# EAGLE design D14_1_0 (EAGLE 8.3.2)
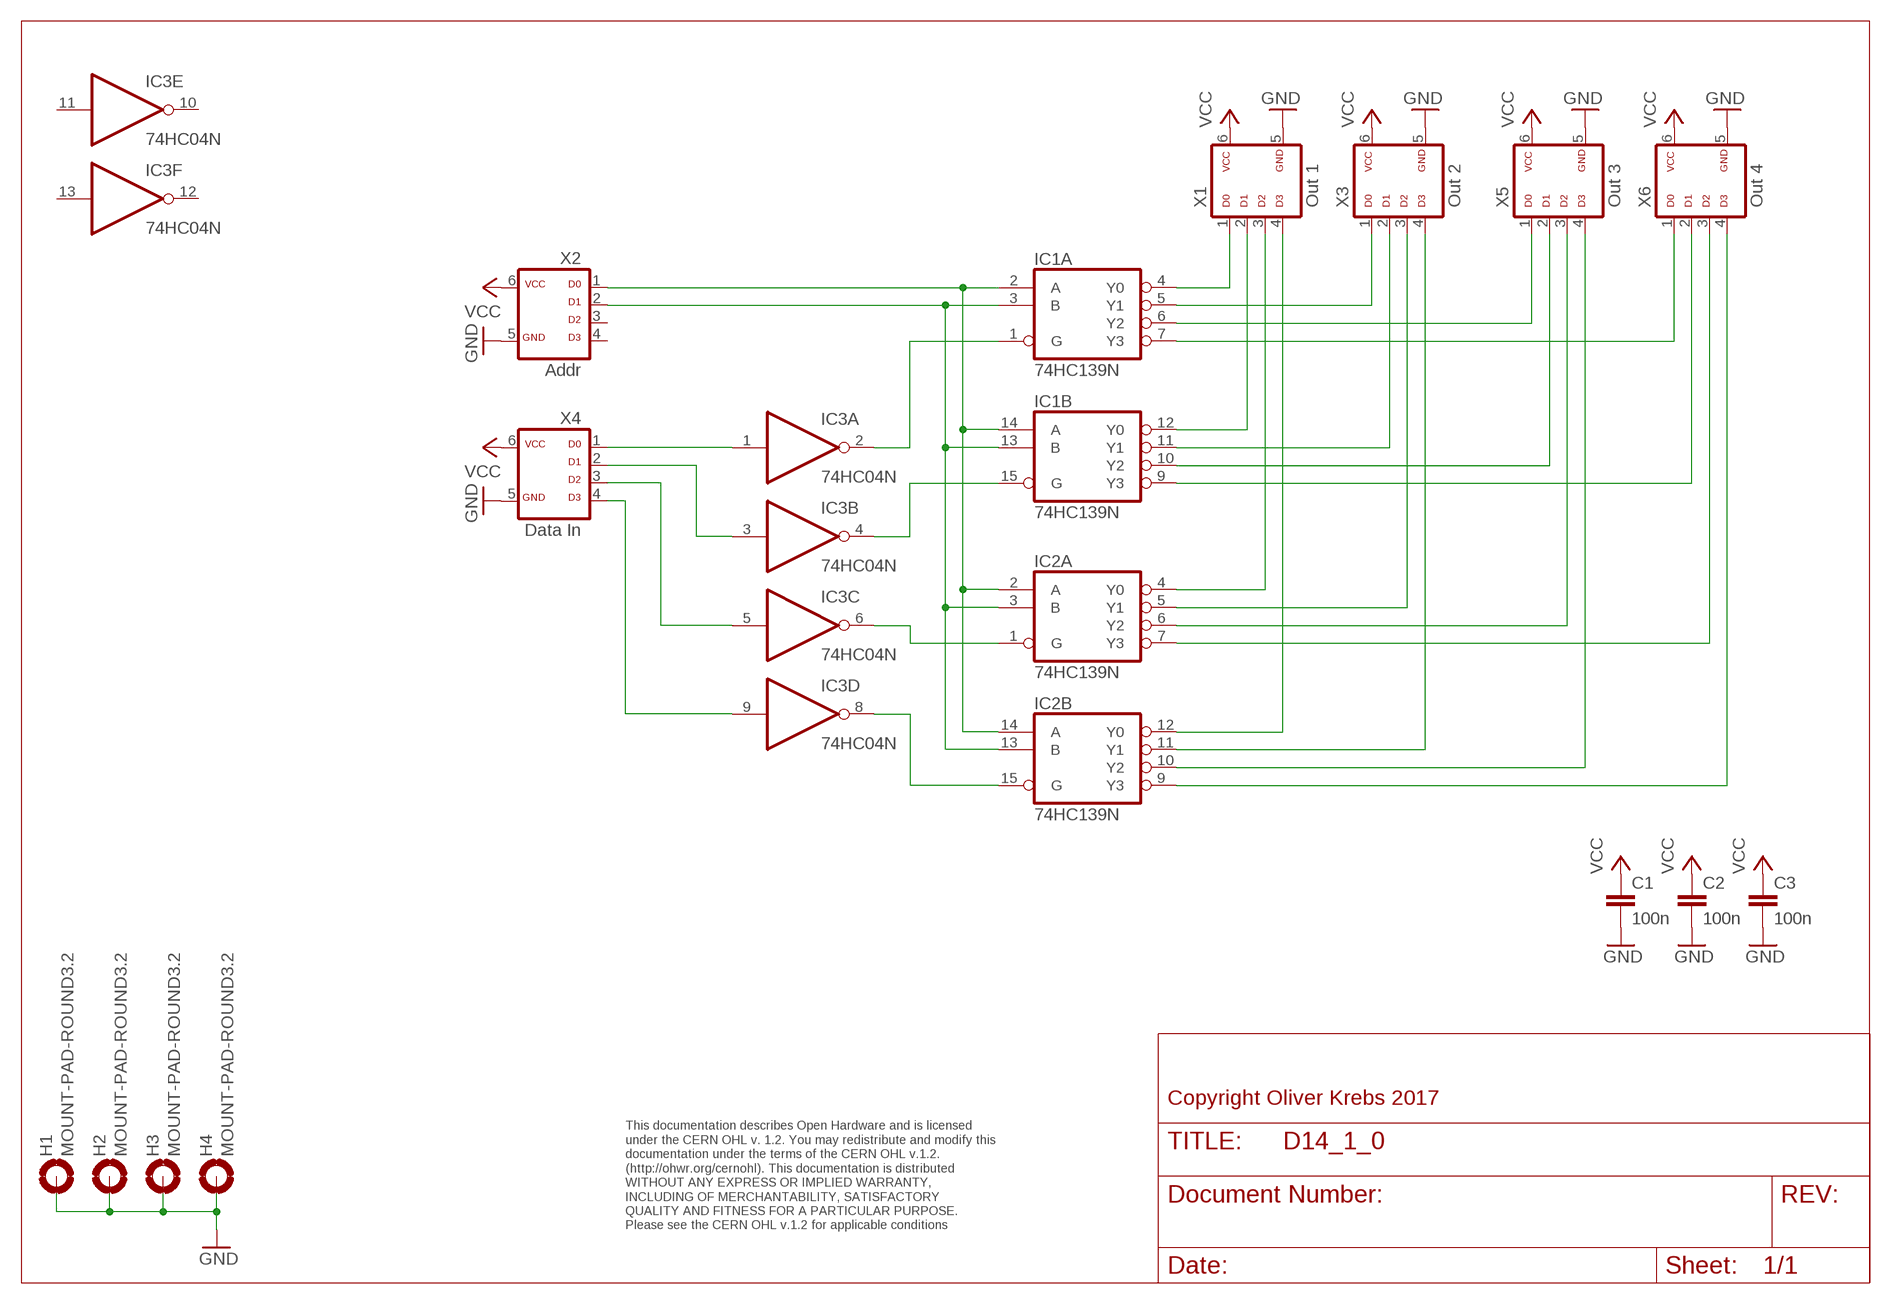
[diagram p0: schematic, sheet 1]

## Parts
C1  100n  C-EU050-025X075  [C050-025X075]
C2  100n  C-EU050-025X075  [C050-025X075]
C3  100n  C-EU050-025X075  [C050-025X075]
H1  MOUNT-PAD-ROUND3.2  [3,2-PAD]
H2  MOUNT-PAD-ROUND3.2  [3,2-PAD]
H3  MOUNT-PAD-ROUND3.2  [3,2-PAD]
H4  MOUNT-PAD-ROUND3.2  [3,2-PAD]
IC1  74HC139N  [DIL16]
IC2  74HC139N  [DIL16]
IC3  74HC04N  [DIL14]
X1  Out 1  ML6D  [ML-6]
X2  Addr  ML6D  [ML-6]
X3  Out 2  ML6D  [ML-6]
X4  Data In  ML6D  [ML-6]
X5  Out 3  ML6D  [ML-6]
X6  Out 4  ML6D  [ML-6]

## Nets
GND: C1.2 C2.2 C3.2 H1.B3,2(MOUNT) H2.B3,2(MOUNT) H3.B3,2(MOUNT) H4.B3,2(MOUNT) X1.5 X2.5 X3.5 X4.5 X5.5 X6.5
N$1: IC1.2(A:A) IC1.14(B:A) IC2.2(A:A) IC2.14(B:A) X2.1
N$2: IC1.3(A:B) IC1.13(B:B) IC2.3(A:B) IC2.13(B:B) X2.2
N$3: IC1.4(A:Y0) X1.1
N$4: IC1.12(B:Y0) X1.2
N$5: IC2.4(A:Y0) X1.3
N$6: IC2.12(B:Y0) X1.4
N$7: IC1.5(A:Y1) X3.1
N$8: IC1.11(B:Y1) X3.2
N$9: IC2.5(A:Y1) X3.3
N$10: IC2.11(B:Y1) X3.4
N$11: IC1.6(A:Y2) X5.1
N$12: IC1.10(B:Y2) X5.2
N$13: IC2.6(A:Y2) X5.3
N$14: IC2.10(B:Y2) X5.4
N$15: IC1.7(A:Y3) X6.1
N$16: IC1.9(B:Y3) X6.2
N$17: IC2.7(A:Y3) X6.3
N$18: IC2.9(B:Y3) X6.4
N$19: IC1.1(A:G) IC3.2(A:O)
N$20: IC1.15(B:G) IC3.4(B:O)
N$21: IC2.1(A:G) IC3.6(C:O)
N$22: IC2.15(B:G) IC3.8(D:O)
N$23: IC3.1(A:I) X4.1
N$24: IC3.3(B:I) X4.2
N$25: IC3.5(C:I) X4.3
N$26: IC3.9(D:I) X4.4
VCC: C1.1 C2.1 C3.1 X1.6 X2.6 X3.6 X4.6 X5.6 X6.6
Unconnected: IC3.10(E:O) IC3.11(E:I) IC3.12(F:O) IC3.13(F:I) X2.3 X2.4

## Notes on the sheet
- Copyright Oliver Krebs 2017
- This documentation describes Open Hardware and is licensed 
  under the CERN OHL v. 1.2. You may redistribute and modify this 
  documentation under the terms of the CERN OHL v.1.2. 
  (http://ohwr.org/cernohl). This documentation is distributed
  WITHOUT ANY EXPRESS OR IMPLIED WARRANTY, 
  INCLUDING OF MERCHANTABILITY, SATISFACTORY 
  QUALITY AND FITNESS FOR A PARTICULAR PURPOSE. 
  Please see the CERN OHL v.1.2 for applicable conditions

## Power pins joined to a net without a drawn wire
GND: IC1.8(P:GND) IC2.8(P:GND) IC3.7(P:GND)
VCC: IC1.16(P:VCC) IC2.16(P:VCC) IC3.14(P:VCC)

## Library data of the parts
C1-C3 = 01-my_rcl:C-EU: CAPACITOR, European symbol
H1-H4 = holes:MOUNT-PAD-ROUND: MOUNTING PAD, round
IC1 IC2 = 74xx-eu:74*139: Dual 2-line to 4-line DECODER/DEMULTIPLEXER
IC3 = 74xx-eu:74*04: Hex INVERTER
X1-X6 = 01-my-con:ML6D

## Board
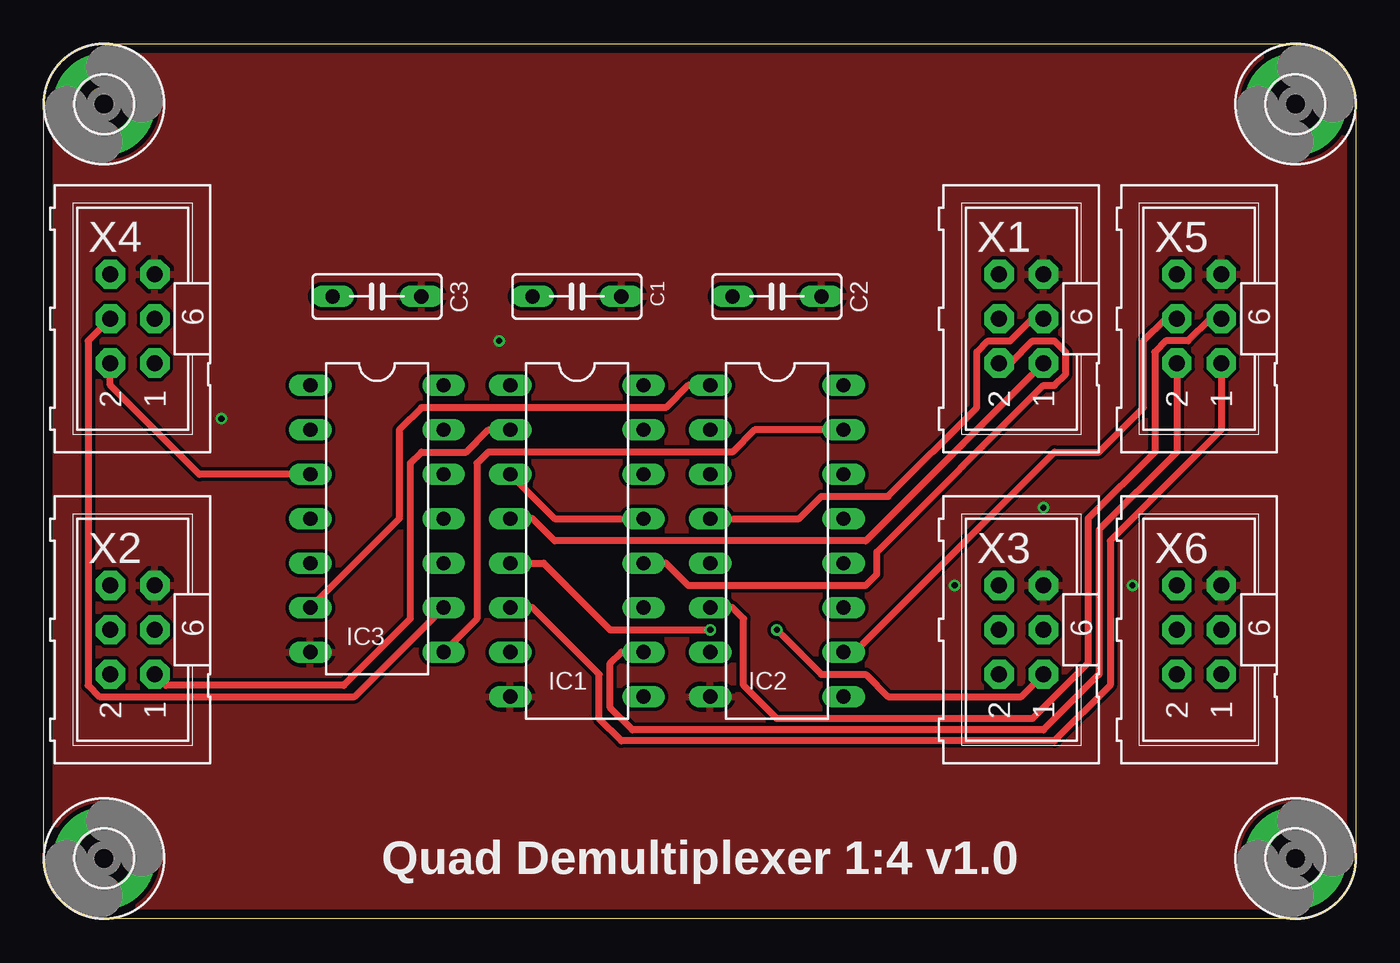
[diagram p1: board, top side]
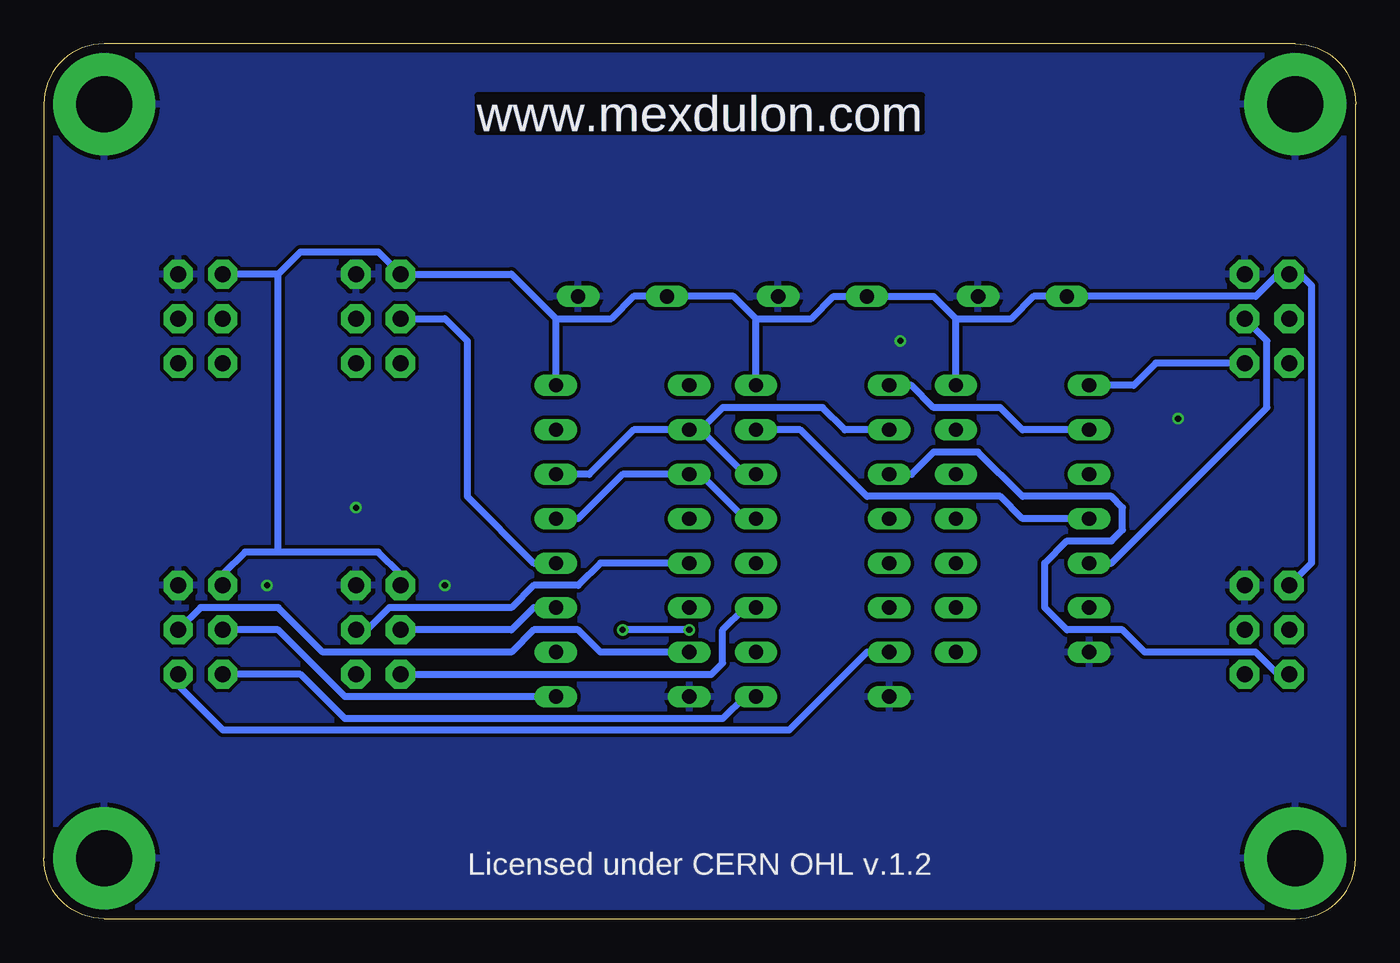
[diagram p2: board, bottom side, seen from below]

Size 75 x 50 mm. Coordinates in mm from the lower left corner, seen from the top.
Outline: 0,3.45 0,46.55 arc-90 3.45,50 71.55,50 arc-90 75,46.55 75,3.45 arc-90 71.55,0 3.45,0 arc-90 0,3.45
Copper layers (1*16): Top 0.035mm / dielectric 1.6mm / Bottom 0.035mm
Design rules "Elecrow_2-layer_PCB_eagle_rule_8mil": minimum track width 8mil, minimum drill 12mil, track to track 8mil, track to pad 8mil, pad to pad 8mil, via to via 8mil, smd to smd 0mil, copper to edge 20mil, drill to drill 10mil, minimum pad ring 6mil, minimum via ring 6mil, stop-mask expansion 0mil, vias tented up to drill 100mil, thermal gap 10mil

### Footprints (pad centres in the part's own frame; a part is rotated, then mirrored left to right if it is on the bottom)
C050-025X075 = drill 0.813 long: 1 -2.54,0; 2 2.54,0
3,2-PAD = drill 3.2 pad 5.842: B3,2 0,0
DIL16 = drill 0.813 long: 1 -8.89,-3.81; 2 -6.35,-3.81; 3 -3.81,-3.81; 4 -1.27,-3.81; 5 1.27,-3.81; 6 3.81,-3.81; 7 6.35,-3.81; 8 8.89,-3.81; 9 8.89,3.81; 10 6.35,3.81; 11 3.81,3.81; 12 1.27,3.81; 13 -1.27,3.81; 14 -3.81,3.81; 15 -6.35,3.81; 16 -8.89,3.81
DIL14 = drill 0.813 long: 1 -7.62,-3.81; 2 -5.08,-3.81; 3 -2.54,-3.81; 4 0,-3.81; 5 2.54,-3.81; 6 5.08,-3.81; 7 7.62,-3.81; 8 7.62,3.81; 9 5.08,3.81; 10 2.54,3.81; 11 0,3.81; 12 -2.54,3.81; 13 -5.08,3.81; 14 -7.62,3.81
ML-6 = drill 0.914 pad 1.676 octagon: 1 -2.54,-1.27; 2 -2.54,1.27; 3 0,-1.27; 4 0,1.27; 5 2.54,-1.27; 6 2.54,1.27

### Placement (x,y rotation side)
C1  30.48,35.56 0 top
C2  41.91,35.56 0 top
C3  19.05,35.56 0 top
H1  3.45,3.45 0 top
H2  3.45,46.55 0 top
H3  71.55,46.55 0 top
H4  71.55,3.45 0 top
IC1  30.48,21.59 270 top
IC2  41.91,21.59 270 top
IC3  19.05,22.86 270 top
X1  55.88,34.29 90 top
X2  5.08,16.51 90 top
X3  55.88,16.51 90 top
X4  5.08,34.29 90 top
X5  66.04,34.29 90 top
X6  66.04,16.51 90 top

### Tracks (layer width: path | path; a pad name or v marks a point on that pad's centre or on a via)
GND  (via drill 0.35)
  other vias: 10.16,28.57 26.04,33.02 57.15,23.5 62.23,19.05 52.07,19.05
  pour Bottom (isolate 0.203): 0,50.16 76.2,50.16 76.2,0 0,0
  pour Top (isolate 0.203): 0,50.16 76.2,50.16 76.2,0 0,0
N$1
  Top 0.406: IC1.2 25.4,27.94 24.13,26.67 21.59,26.67 20.95,26.04 20.95,17.14 17.14,13.34 6.99,13.34 X2.1
  Bottom 0.406: 37.47,27.94 IC2.2 41.27,27.94 43.81,25.4 IC2.14 | 37.47,27.94 34.92,25.4 IC1.14 | IC1.2 29.21,27.94 30.48,29.21 36.2,29.21 37.47,27.94
N$2
  Top 0.406: IC1.3 29.21,22.86 IC1.13
  Bottom 0.406: IC2.13 44.45,22.86 41.91,25.4 IC2.3 37.47,25.4 34.92,22.86 IC1.13 | X2.2 4.45,13.97 5.71,15.24 12.06,15.24 13.34,16.51 16.51,16.51 17.78,17.78 17.78,20.32 16.51,21.59 13.97,21.59 13.34,22.23 13.34,23.5 13.97,24.13 19.05,24.13 21.59,26.67 24.13,26.67 25.4,25.4 IC1.3
N$3
  Top 0.406: IC1.4 27.94,22.86 29.21,21.59 46.99,21.59 X1.1
N$4
  Top 0.406: X1.2 55.24,31.75 56.52,33.02 57.78,33.02 58.42,32.38 58.42,31.11 57.78,30.48 57.15,30.48 47.62,20.95 47.62,19.68 46.99,19.05 36.83,19.05 35.56,20.32 IC1.12
N$5
  Top 0.406: IC2.4 43.18,22.86 44.45,24.13 48.26,24.13 53.34,29.21 53.34,32.38 53.98,33.02 55.24,33.02 56.52,34.29 X1.3
N$6
  Bottom 0.406: X1.4 52.07,34.29 50.8,33.02 50.8,24.13 46.99,20.32 IC2.12
N$7  (via drill 0.35)
  Top 0.406: IC1.5 28.57,20.32 32.38,16.51 v38.1,16.51 | v41.91,16.51 44.45,13.97 46.99,13.97 48.26,12.7 55.88,12.7 X3.1
  Bottom 0.406: v38.1,16.51 v41.91,16.51
N$8
  Bottom 0.406: X3.2 36.83,13.97 36.2,14.61 36.2,16.51 34.92,17.78 IC1.11
N$9
  Bottom 0.406: IC2.5 43.18,20.32 44.45,19.05 46.99,19.05 48.26,17.78 55.24,17.78 56.52,16.51 X3.3
N$10
  Bottom 0.406: IC2.11 46.99,17.78 48.26,16.51 X3.4
N$11
  Top 0.406: X5.1 67.31,27.94 60.96,21.59 60.96,13.34 57.78,10.16 33.02,10.16 31.75,11.43 31.75,13.97 27.94,17.78 IC1.6
N$12
  Top 0.406: X5.2 64.77,26.67 60.33,22.23 60.33,13.97 57.15,10.79 33.66,10.79 32.38,12.06 32.38,14.61 33.02,15.24 IC1.10
N$13
  Top 0.406: X5.3 66.67,34.29 65.41,33.02 64.14,33.02 63.5,32.38 63.5,26.67 59.69,22.86 59.69,14.61 56.52,11.43 41.91,11.43 40.01,13.34 40.01,17.14 39.37,17.78 IC2.6
N$14
  Top 0.406: IC2.10 46.35,15.24 57.78,26.67 60.33,26.67 62.87,29.21 62.87,33.02 64.14,34.29 X5.4
N$15
  Bottom 0.406: X6.1 67.31,13.34 64.77,10.79 32.38,10.79 27.94,15.24 IC1.7
N$16
  Bottom 0.406: IC1.9 34.92,12.7 36.2,11.43 57.78,11.43 60.33,13.97 X6.2
N$17
  Bottom 0.406: IC2.7 43.18,15.24 44.45,16.51 46.99,16.51 48.26,15.24 59.05,15.24 61.59,17.78 66.04,17.78 X6.3
N$18
  Bottom 0.406: IC2.9 57.78,12.7 61.59,16.51 X6.4
N$19
  Bottom 0.406: IC3.2 19.05,27.94 20.32,29.21 24.13,29.21 25.4,30.48 IC1.1
N$20
  Bottom 0.406: IC3.4 19.05,22.86 20.32,24.13 27.94,24.13 31.75,27.94 IC1.15
N$21
  Top 0.406: IC2.1 36.83,30.48 35.56,29.21 21.59,29.21 20.32,27.94 20.32,22.86 IC3.6
N$22
  Top 0.406: IC2.15 40.64,27.94 39.37,26.67 25.4,26.67 24.77,26.04 24.77,17.14 IC3.8
N$23
  Bottom 0.406: X4.1 11.43,31.75 12.7,30.48 IC3.1
N$24
  Top 0.406: IC3.3 8.89,25.4 3.81,30.48 X4.2
N$25
  Bottom 0.406: IC3.5 13.97,20.32 5.08,29.21 5.08,33.02 X4.3
N$26
  Top 0.406: X4.4 2.54,33.02 2.54,13.34 3.17,12.7 17.78,12.7 IC3.9
VCC
  Bottom 0.406: 22.86,34.29 19.68,34.29 18.41,35.56 C3.1 5.71,35.56 4.45,36.83 X4.6 3.17,36.83 2.54,36.2 2.54,20.32 X2.6 | 22.86,34.29 24.13,35.56 C1.1 29.84,35.56 31.11,34.29 34.29,34.29 | IC3.14 22.86,34.29 | IC1.16 34.29,34.29 | 34.29,34.29 35.56,35.56 C2.1 41.27,35.56 42.55,34.29 45.72,34.29 | 45.72,34.29 48.26,36.83 X1.6 55.88,38.1 60.33,38.1 61.59,36.83 | IC2.16 45.72,34.29 | X3.6 54.61,19.68 55.88,20.95 61.59,20.95 | 61.59,20.95 63.5,20.95 64.77,19.68 X6.6 | 61.59,36.83 X5.6 | 61.59,20.95 61.59,36.83

### Text on the board
Bottom: www.mexdulon.com
tNames: Quad Demultiplexer 1:4 v1.0
bNames: www.mexdulon.com | Licensed under CERN OHL v.1.2
200bmp: E:/Bilder/Elektronik/Modulion/Mexdulon/mexdulon_50x50_pcb.bmp